# Altium project ArDINo DUAL OC OUTPUT.PrjPCB
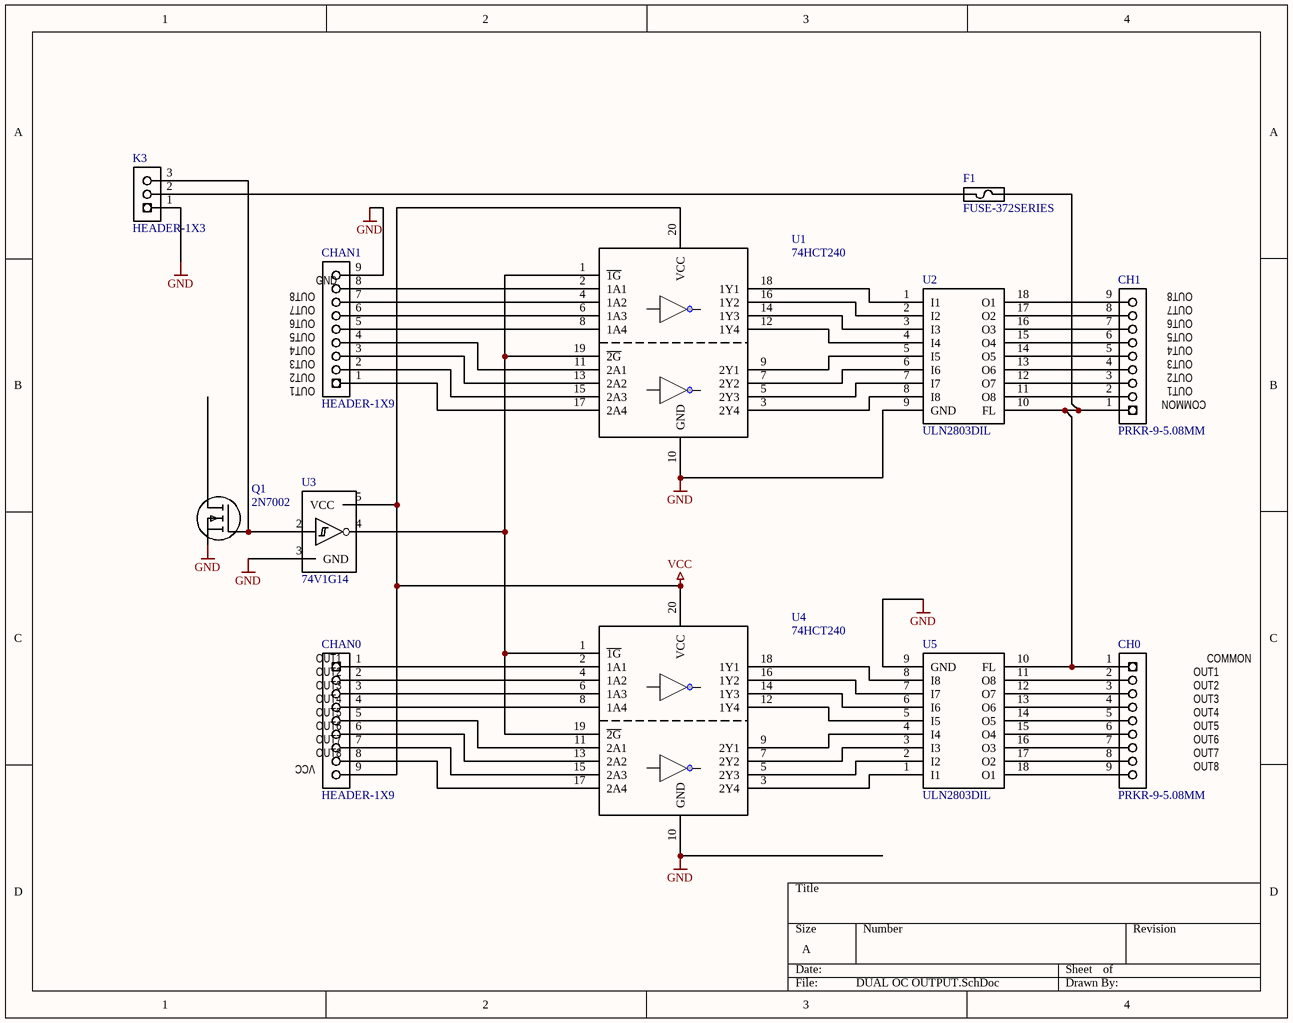
[diagram p0: DUAL OC OUTPUT.SchDoc]
1 sheet, 12 parts. Net scope: global (net labels, ports and power ports of the same name join across sheets).
Board file: DUAL OC OUTPUT.PcbDoc

## Sheet DUAL OC OUTPUT.SchDoc
size A

### Parts
CH0  PRKR-9-5.08MM  [PRKR-9-5.08MM]
CH1  PRKR-9-5.08MM  [PRKR-9-5.08MM]
CHAN0  HEADER-1X9  [HEADER-1X9]
CHAN1  HEADER-1X9  [HEADER-1X9]
F1  FUSE-372SERIES  [FUSE-372]
K3  HEADER-1X3  [HEADER-1X3]
Q1  2N7002  [SOT23-GDS]
U1  74HCT240  [DIP20]
U2  ULN2803DIL  [DIP18]
U3  74V1G14  [SOT23-5]
U4  74HCT240  [DIP20]
U5  ULN2803DIL  [DIP18]

### Nets
GND: CHAN1.9 K3.1 Q1.S U1.10(GND) U2.9(GND) U3.3(GND) U4.10(GND) U5.9(GND)
VCC: CHAN0.9 U1.20(VCC) U3.5(VCC) U4.20(VCC)
NetCH0_1: CH0.1 CH1.1 F1.1 U2.10(FL) U5.10(FL)
NetCH0_2: CH0.2 U5.11(O8)
NetCH0_3: CH0.3 U5.12(O7)
NetCH0_4: CH0.4 U5.13(O6)
NetCH0_5: CH0.5 U5.14(O5)
NetCH0_6: CH0.6 U5.15(O4)
NetCH0_7: CH0.7 U5.16(O3)
NetCH0_8: CH0.8 U5.17(O2)
NetCH0_9: CH0.9 U5.18(O1)
NetCH1_2: CH1.2 U2.11(O8)
NetCH1_3: CH1.3 U2.12(O7)
NetCH1_4: CH1.4 U2.13(O6)
NetCH1_5: CH1.5 U2.14(O5)
NetCH1_6: CH1.6 U2.15(O4)
NetCH1_7: CH1.7 U2.16(O3)
NetCH1_8: CH1.8 U2.17(O2)
NetCH1_9: CH1.9 U2.18(O1)
NetCHAN0_1: CHAN0.1 U4.2(1A1)
NetCHAN0_2: CHAN0.2 U4.4(1A2)
NetCHAN0_3: CHAN0.3 U4.6(1A3)
NetCHAN0_4: CHAN0.4 U4.8(1A4)
NetCHAN0_5: CHAN0.5 U4.11(2A1)
NetCHAN0_6: CHAN0.6 U4.13(2A2)
NetCHAN0_7: CHAN0.7 U4.15(2A3)
NetCHAN0_8: CHAN0.8 U4.17(2A4)
NetCHAN1_1: CHAN1.1 U1.17(2A4)
NetCHAN1_2: CHAN1.2 U1.15(2A3)
NetCHAN1_3: CHAN1.3 U1.13(2A2)
NetCHAN1_4: CHAN1.4 U1.11(2A1)
NetCHAN1_5: CHAN1.5 U1.8(1A4)
NetCHAN1_6: CHAN1.6 U1.6(1A3)
NetCHAN1_7: CHAN1.7 U1.4(1A2)
NetCHAN1_8: CHAN1.8 U1.2(1A1)
NetF1_2: F1.2 K3.2
NetK3_3: K3.3 Q1.G U3.2
NetU1_1: U1.1(~{1G}) U1.19(~{2G}) U3.4 U4.1(~{1G}) U4.19(~{2G})
NetU1_3: U1.3(2Y4) U2.8(I8)
NetU1_5: U1.5(2Y3) U2.7(I7)
NetU1_7: U1.7(2Y2) U2.6(I6)
NetU1_9: U1.9(2Y1) U2.5(I5)
NetU1_12: U1.12(1Y4) U2.4(I4)
NetU1_14: U1.14(1Y3) U2.3(I3)
NetU1_16: U1.16(1Y2) U2.2(I2)
NetU1_18: U1.18(1Y1) U2.1(I1)
NetU4_3: U4.3(2Y4) U5.1(I1)
NetU4_5: U4.5(2Y3) U5.2(I2)
NetU4_7: U4.7(2Y2) U5.3(I3)
NetU4_9: U4.9(2Y1) U5.4(I4)
NetU4_12: U4.12(1Y4) U5.5(I5)
NetU4_14: U4.14(1Y3) U5.6(I6)
NetU4_16: U4.16(1Y2) U5.7(I7)
NetU4_18: U4.18(1Y1) U5.8(I8)

Not connected (* = marked no-connect by the designer): Q1 D

### Notes on the sheet
- (near CHAN1) GND
- (near CHAN1) OUT7
- (near CHAN1) OUT8
- (near CH1) OUT7
- (near CH1) OUT8
- (near CHAN1) OUT2
- (near CHAN1) OUT3
- (near CHAN1) OUT4
- (near CHAN1) OUT5
- (near CHAN1) OUT6
- (near CH1) OUT2
- (near CH1) OUT3
- (near CH1) OUT4
- (near CH1) OUT5
- (near CH1) OUT6
- (near CHAN1) OUT1
- (near CH1) OUT1
- (near CH1) COMMON
- (near CHAN0) OUT1
- (near CHAN0) OUT2
- (near CHAN0) OUT3
- (near CHAN0) OUT4
- (near CH0) OUT1
- (near CH0) OUT2
- (near CH0) OUT3
- (near CH0) COMMON
- (near CHAN0) VCC
- (near CHAN0) OUT5
- (near CHAN0) OUT6
- (near CHAN0) OUT7
- (near CHAN0) OUT8
- (near CH0) OUT4
- (near CH0) OUT5
- (near CH0) OUT6
- (near CH0) OUT7
- (near CH0) OUT8

### Library data of the parts
F1 = FUSE-372SERIES: FUSE-372
Q1 = 2N7002-SOT23: N CHANNEL MOSFET 2N7002 SOT23; Manufacturer: Fairchild Semiconductor; Drain to Source Voltage (Vdss): 60V; Vgs(th) (Max) @ Id: 2.5V @ 250µA; Power - Max: 200mW; Current - Continuous Drain (Id) @ 25° C: 115mA; Rds On (Max) @ Id, Vgs: 7.5 Ohm @ 500mA, 10V; FET Type: MOSFET N-Channel, Metal Oxide; FET Feature: Logic Level Gate; Input Capacitance (Ciss) @ Vds: 50pF @ 25V; Description: MOSFET N-CH 60V 115MA SOT-23; Reel: Q2; Supplier 1: Digi-Key; Supplier Part Number 1: 2N7002NTR-ND; Package / Case: SOT-23-3, TO-236-3, Micro3™, SSD3, SST3; RoHS: RoHS Compliant; Mounting Type: Surface Mount; Packaging: Tape & Reel (TR); Gate Charge (Qg) @ Vgs: -; Supplier Part Number: 2N7002NTR-ND; Supplier: Digi-Key; Category: Discrete Semiconductor Products; Manufacturer Part Number: 2N7002
U1 U4 = 74240DIL: 74240
U2 U5 = ULN2803DIL: OCTAL HIGH CURRENT DRIVER; Manufacturer: Texas Instruments; Manufacturer Part Number: ULN2803ADWR; Number of Drivers/Receivers: 8/0; Description: IC DARL TRANS ARRAY HV 18-SOIC; Voltage - Supply: 5V; Supplier 1: Digi-Key; Supplier Part Number 1: 296-15777-1-ND; Packaging: Cut Tape (CT); Supplier Part Number: 296-15777-1-ND; Type: Darlington Array; Supplier: Digi-Key; Protocol: -; Package / Case: 18-SOIC (7.5mm Width); Category: Integrated Circuits (ICs); RoHS: RoHS Compliant
U3 = 74V1G14: SINGLE GATE SCHMITTTRIGGER
CH0 CH1 = PRKR-9-5.08MM: Supplier 1: Digi-Key; Supplier Part Number 1: S1011E-36-ND
CHAN0 CHAN1 = HEADER-1X9: Supplier 1: Digi-Key; Supplier Part Number 1: S1011E-36-ND
K3 = HEADER-1X3: Supplier 1: Digi-Key; Supplier Part Number 1: S1011E-36-ND